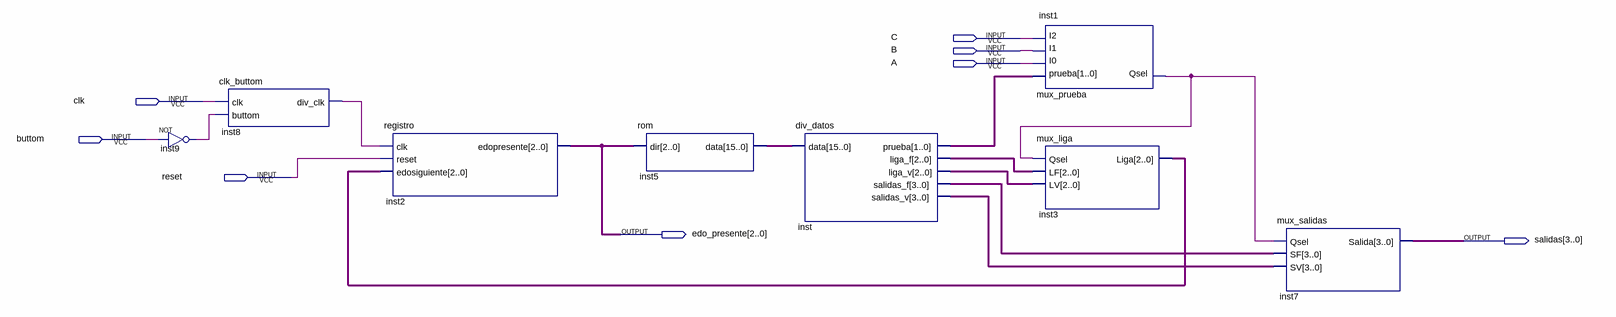
[diagram p0: schematic sheet]
// Quartus schematic practica4.bdf as structural Verilog: 8 symbols, 8 pins
module practica4 (
  input  C,
  input  B,
  input  A,
  input  clk,
  input  buttom,
  input  reset,
  output [2:0] edo_presente,
  output [3:0] salidas
);

  wire inst1_qsel, inst8_div_clk, inst9_out;
  wire [1:0] inst_prueba;
  wire [2:0] inst3_liga, inst_liga_f, inst_liga_v;
  wire [3:0] inst_salidas_f, inst_salidas_v;
  wire [15:0] inst5_data;

  not inst9 (inst9_out, buttom);
  clk_buttom inst8 (.clk(clk), .buttom(inst9_out), .div_clk(inst8_div_clk));
  registro inst2 (.clk(inst8_div_clk), .reset(reset), .edosiguiente(inst3_liga), .edopresente(edo_presente));
  rom inst5 (.dir(edo_presente), .data(inst5_data));
  div_datos inst (
    .data(inst5_data), .prueba(inst_prueba), .liga_f(inst_liga_f), .liga_v(inst_liga_v),
    .salidas_f(inst_salidas_f), .salidas_v(inst_salidas_v));
  mux_prueba inst1 (.prueba(inst_prueba), .I0(A), .I1(B), .I2(C), .Qsel(inst1_qsel));
  mux_liga inst3 (.Qsel(inst1_qsel), .LF(inst_liga_f), .LV(inst_liga_v), .Liga(inst3_liga));
  mux_salidas inst7 (.Qsel(inst1_qsel), .SF(inst_salidas_f), .SV(inst_salidas_v), .Salida(salidas));
endmodule
